# Altium schematic sheet uC.SchDoc: Microcontroller
size A3; Author: Valentin Py; DrawnBy: Valentin Py; Engineer: Valentin Py; Address1: valentin.py@gmail.com; SheetNumber: 4; SheetTotal: 5; PageSetup: Record=PageOptions|CenterHorizontal=True|CenterVertical=True|PrintScale=0.24|XCorrection=1.00|YCorrection=1.00|PrintKind=0|BorderSize=5000000|LeftOffset=0|BottomOffset=0|Orientation=2|PaperLength=1000|PaperWidth=1000|Scale=100|PaperSource=7|PrintQuality=-4|MediaType=1|DitherType=10|PaperKind=A4|PrintScaleMode=1
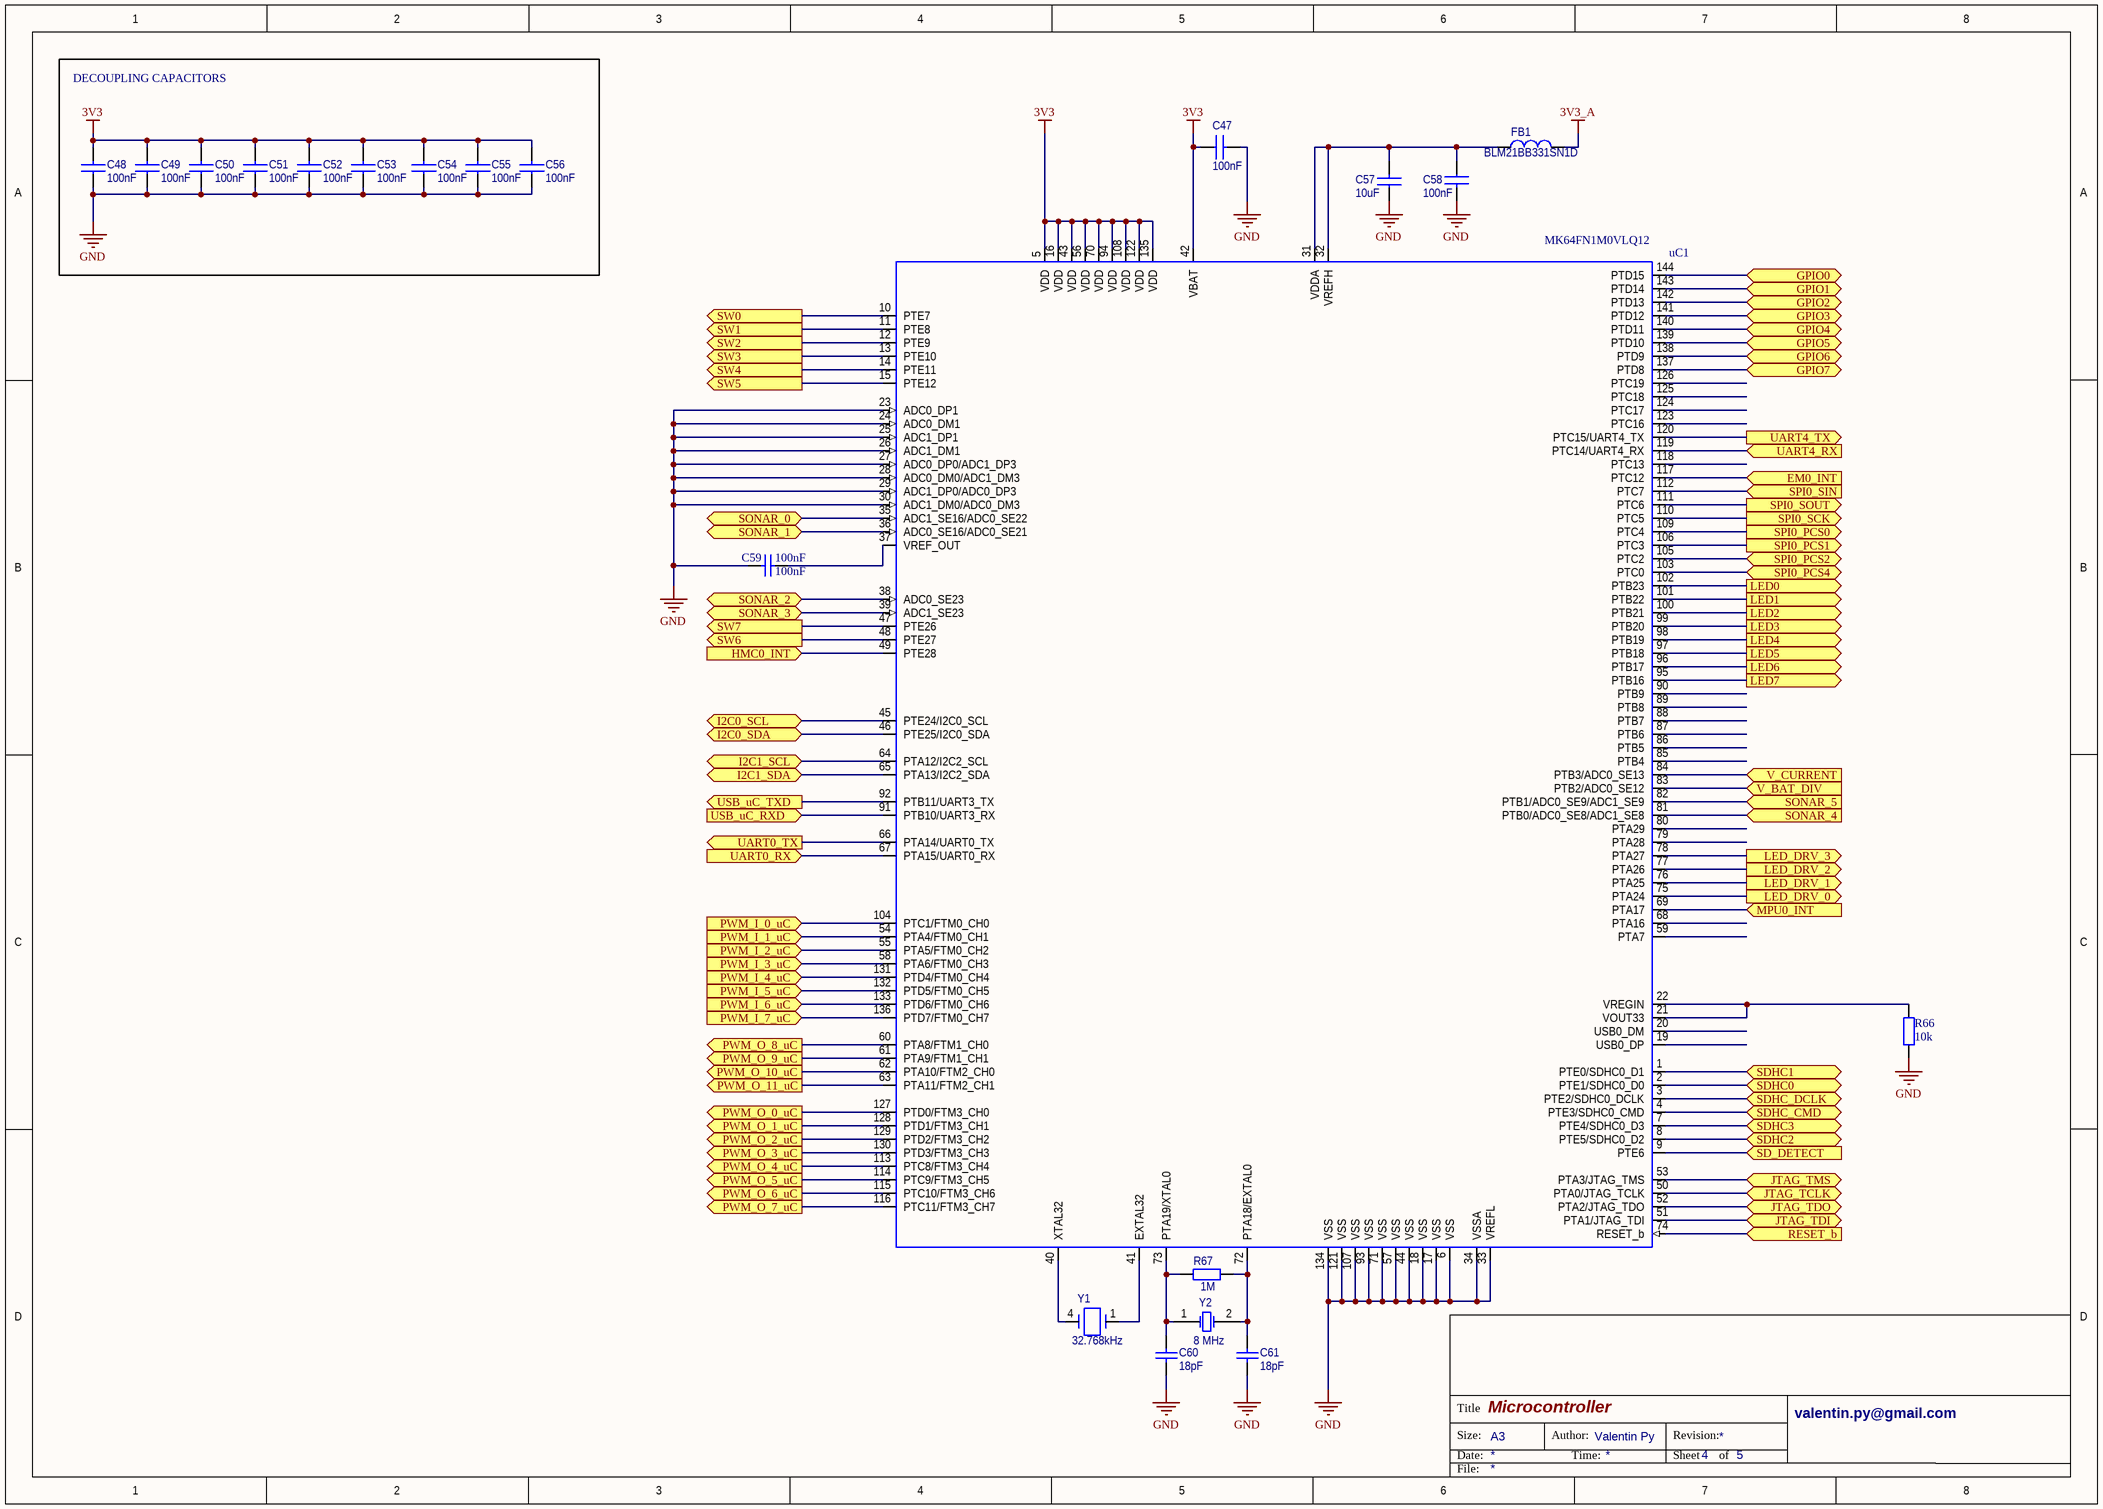
[diagram p0: uC.SchDoc]

## Parts
C47  100nF  [080503]
C48  100nF  [080503]
C49  100nF  [080503]
C50  100nF  [080503]
C51  100nF  [080503]
C52  100nF  [080503]
C53  100nF  [080503]
C54  100nF  [080503]
C55  100nF  [080503]
C56  100nF  [080503]
C57  10uF  [080503]
C58  100nF  [080503]
C59  100nF  [080503]
C60  18pF  [060301]
C61  18pF  [060301]
FB1  BLM21BB331SN1D  [080501]
R66  10k  [060301]
R67  1M  [060301]
uC1  MK64FN1M0VLQ12  [LQFP 144]
Y1  value 32.768kHz  [XT-5]  (hidden comment: CRYSTAL 32.768k)
Y2  value 8 MHz  [XT8_2-SMD]  (hidden comment: ABM3-8.000MHZ-D2Y-T)

## Blocks framed on the sheet
DECOUPLING CAPACITORS: C48-C56

## Ports
EM0_INT (in), GPIO0 (bidir), GPIO1 (bidir), GPIO2 (bidir), GPIO3 (bidir), GPIO4 (bidir), GPIO5 (bidir), GPIO6 (bidir), GPIO7 (bidir), HMC0_INT (in), I2C0_SCL (bidir), I2C0_SDA (bidir), I2C1_SCL (bidir), I2C1_SDA, JTAG_TCLK, JTAG_TDI, JTAG_TDO, JTAG_TMS, LED0 (out), LED1 (out), LED2 (out), LED3 (out), LED4 (out), LED5 (out), LED6 (out), LED7 (out), LED_DRV_0 (out), LED_DRV_1 (out), LED_DRV_2 (out), LED_DRV_3 (out), MPU0_INT (in), PWM_I_0_uC (in), PWM_I_1_uC (in), PWM_I_2_uC (in), PWM_I_3_uC (in), PWM_I_4_uC (in), PWM_I_5_uC (in), PWM_I_6_uC (in), PWM_I_7_uC (in), PWM_O_0_uC (out), PWM_O_1_uC (out), PWM_O_2_uC (out), PWM_O_3_uC (out), PWM_O_4_uC (out), PWM_O_5_uC (out), PWM_O_6_uC (out), PWM_O_7_uC (out), PWM_O_8_uC (out), PWM_O_9_uC (out), PWM_O_10_uC (out), PWM_O_11_uC (out), RESET_b (in), SD_DETECT (in), SDHC0, SDHC1, SDHC2, SDHC3, SDHC_CMD, SDHC_DCLK, SONAR_0, SONAR_1, SONAR_2, SONAR_3, SONAR_4 (in), SONAR_5 (in), SPI0_PCS0 (out), SPI0_PCS1 (out), SPI0_PCS2, SPI0_PCS4, SPI0_SCK (out), SPI0_SIN (in), SPI0_SOUT (out), SW0 (out), SW1 (out), SW2 (out), SW3 (out), SW4 (out), SW5 (out), SW6 (out), SW7 (out), UART0_RX (in), UART0_TX (out), UART4_RX (in), UART4_TX (out), USB_uC_RXD (in), USB_uC_TXD (out), V_BAT_DIV (in), V_CURRENT (in)

## Nets
3V3: C47.1 C48.2 C49.2 C50.2 C51.2 C52.2 C53.2 C54.2 C55.2 C56.2 uC1.5(VDD) uC1.16(VDD) uC1.42(VBAT) uC1.43(VDD) uC1.56(VDD) uC1.70(VDD) uC1.94(VDD) uC1.108(VDD) uC1.122(VDD) uC1.135(VDD)
3V3_A: FB1.2
GND: C47.2 C48.1 C49.1 C50.1 C51.1 C52.1 C53.1 C54.1 C55.1 C56.1 C57.1 C58.2 C59.2 C60.1 C61.1 R66.1 uC1.6(VSS) uC1.17(VSS) uC1.18(VSS) uC1.23(ADC0_DP1) uC1.24(ADC0_DM1) uC1.25(ADC1_DP1) uC1.26(ADC1_DM1) uC1.27(ADC0_DP0/ADC1_DP3) uC1.28(ADC0_DM0/ADC1_DM3) uC1.29(ADC1_DP0/ADC0_DP3) uC1.30(ADC1_DM0/ADC0_DM3) uC1.33(VREFL) uC1.34(VSSA) uC1.44(VSS) uC1.57(VSS) uC1.71(VSS) uC1.93(VSS) uC1.107(VSS) uC1.121(VSS) uC1.134(VSS)
EM0_INT: uC1.117(PTC12) ; port EM0_INT
GPIO0: uC1.144(PTD15) ; port GPIO0
GPIO1: uC1.143(PTD14) ; port GPIO1
GPIO2: uC1.142(PTD13) ; port GPIO2
GPIO3: uC1.141(PTD12) ; port GPIO3
GPIO4: uC1.140(PTD11) ; port GPIO4
GPIO5: uC1.139(PTD10) ; port GPIO5
GPIO6: uC1.138(PTD9) ; port GPIO6
GPIO7: uC1.137(PTD8) ; port GPIO7
HMC0_INT: uC1.49(PTE28) ; port HMC0_INT
I2C0_SCL: uC1.45(PTE24/I2C0_SCL) ; port I2C0_SCL
I2C0_SDA: uC1.46(PTE25/I2C0_SDA) ; port I2C0_SDA
I2C1_SCL: uC1.64(PTA12/I2C2_SCL) ; port I2C1_SCL
I2C1_SDA: uC1.65(PTA13/I2C2_SDA) ; port I2C1_SDA
JTAG_TCLK: uC1.50(PTA0/JTAG_TCLK) ; port JTAG_TCLK
JTAG_TDI: uC1.51(PTA1/JTAG_TDI) ; port JTAG_TDI
JTAG_TDO: uC1.52(PTA2/JTAG_TDO) ; port JTAG_TDO
JTAG_TMS: uC1.53(PTA3/JTAG_TMS) ; port JTAG_TMS
LED0: uC1.102(PTB23) ; port LED0
LED1: uC1.101(PTB22) ; port LED1
LED2: uC1.100(PTB21) ; port LED2
LED3: uC1.99(PTB20) ; port LED3
LED4: uC1.98(PTB19) ; port LED4
LED5: uC1.97(PTB18) ; port LED5
LED6: uC1.96(PTB17) ; port LED6
LED7: uC1.95(PTB16) ; port LED7
LED_DRV_0: uC1.75(PTA24) ; port LED_DRV_0
LED_DRV_1: uC1.76(PTA25) ; port LED_DRV_1
LED_DRV_2: uC1.77(PTA26) ; port LED_DRV_2
LED_DRV_3: uC1.78(PTA27) ; port LED_DRV_3
MPU0_INT: uC1.69(PTA17) ; port MPU0_INT
PWM_I_0_uC: uC1.104(PTC1/FTM0_CH0) ; port PWM_I_0_uC
PWM_I_1_uC: uC1.54(PTA4/FTM0_CH1) ; port PWM_I_1_uC
PWM_I_2_uC: uC1.55(PTA5/FTM0_CH2) ; port PWM_I_2_uC
PWM_I_3_uC: uC1.58(PTA6/FTM0_CH3) ; port PWM_I_3_uC
PWM_I_4_uC: uC1.131(PTD4/FTM0_CH4) ; port PWM_I_4_uC
PWM_I_5_uC: uC1.132(PTD5/FTM0_CH5) ; port PWM_I_5_uC
PWM_I_6_uC: uC1.133(PTD6/FTM0_CH6) ; port PWM_I_6_uC
PWM_I_7_uC: uC1.136(PTD7/FTM0_CH7) ; port PWM_I_7_uC
PWM_O_0_uC: uC1.127(PTD0/FTM3_CH0) ; port PWM_O_0_uC
PWM_O_1_uC: uC1.128(PTD1/FTM3_CH1) ; port PWM_O_1_uC
PWM_O_2_uC: uC1.129(PTD2/FTM3_CH2) ; port PWM_O_2_uC
PWM_O_3_uC: uC1.130(PTD3/FTM3_CH3) ; port PWM_O_3_uC
PWM_O_4_uC: uC1.113(PTC8/FTM3_CH4) ; port PWM_O_4_uC
PWM_O_5_uC: uC1.114(PTC9/FTM3_CH5) ; port PWM_O_5_uC
PWM_O_6_uC: uC1.115(PTC10/FTM3_CH6) ; port PWM_O_6_uC
PWM_O_7_uC: uC1.116(PTC11/FTM3_CH7) ; port PWM_O_7_uC
PWM_O_8_uC: uC1.60(PTA8/FTM1_CH0) ; port PWM_O_8_uC
PWM_O_9_uC: uC1.61(PTA9/FTM1_CH1) ; port PWM_O_9_uC
PWM_O_10_uC: uC1.62(PTA10/FTM2_CH0) ; port PWM_O_10_uC
PWM_O_11_uC: uC1.63(PTA11/FTM2_CH1) ; port PWM_O_11_uC
RESET_b: uC1.74(RESET_b) ; port RESET_b
SD_DETECT: uC1.9(PTE6) ; port SD_DETECT
SDHC0: uC1.2(PTE1/SDHC0_D0) ; port SDHC0
SDHC1: uC1.1(PTE0/SDHC0_D1) ; port SDHC1
SDHC2: uC1.8(PTE5/SDHC0_D2) ; port SDHC2
SDHC3: uC1.7(PTE4/SDHC0_D3) ; port SDHC3
SDHC_CMD: uC1.4(PTE3/SDHC0_CMD) ; port SDHC_CMD
SDHC_DCLK: uC1.3(PTE2/SDHC0_DCLK) ; port SDHC_DCLK
SONAR_0: uC1.35(ADC1_SE16/ADC0_SE22) ; port SONAR_0
SONAR_1: uC1.36(ADC0_SE16/ADC0_SE21) ; port SONAR_1
SONAR_2: uC1.38(ADC0_SE23) ; port SONAR_2
SONAR_3: uC1.39(ADC1_SE23) ; port SONAR_3
SONAR_4: uC1.81(PTB0/ADC0_SE8/ADC1_SE8) ; port SONAR_4
SONAR_5: uC1.82(PTB1/ADC0_SE9/ADC1_SE9) ; port SONAR_5
SPI0_PCS0: uC1.109(PTC4) ; port SPI0_PCS0
SPI0_PCS1: uC1.106(PTC3) ; port SPI0_PCS1
SPI0_PCS2: uC1.105(PTC2) ; port SPI0_PCS2
SPI0_PCS4: uC1.103(PTC0) ; port SPI0_PCS4
SPI0_SCK: uC1.110(PTC5) ; port SPI0_SCK
SPI0_SIN: uC1.112(PTC7) ; port SPI0_SIN
SPI0_SOUT: uC1.111(PTC6) ; port SPI0_SOUT
SW0: uC1.10(PTE7) ; port SW0
SW1: uC1.11(PTE8) ; port SW1
SW2: uC1.12(PTE9) ; port SW2
SW3: uC1.13(PTE10) ; port SW3
SW4: uC1.14(PTE11) ; port SW4
SW5: uC1.15(PTE12) ; port SW5
SW6: uC1.48(PTE27) ; port SW6
SW7: uC1.47(PTE26) ; port SW7
UART0_RX: uC1.67(PTA15/UART0_RX) ; port UART0_RX
UART0_TX: uC1.66(PTA14/UART0_TX) ; port UART0_TX
UART4_RX: uC1.119(PTC14/UART4_RX) ; port UART4_RX
UART4_TX: uC1.120(PTC15/UART4_TX) ; port UART4_TX
USB_uC_RXD: uC1.91(PTB10/UART3_RX) ; port USB_uC_RXD
USB_uC_TXD: uC1.92(PTB11/UART3_TX) ; port USB_uC_TXD
V_BAT_DIV: uC1.83(PTB2/ADC0_SE12) ; port V_BAT_DIV
V_CURRENT: uC1.84(PTB3/ADC0_SE13) ; port V_CURRENT
NetC57_2: C57.2 C58.1 FB1.1 uC1.31(VDDA) uC1.32(VREFH)
NetC59_1: C59.1 uC1.37(VREF_OUT)
NetC60_2: C60.2 R67.1 uC1.73(PTA19/XTAL0) Y2.1(OSC1)
NetC61_2: C61.2 R67.2 uC1.72(PTA18/EXTAL0) Y2.2(OSC2)
NetR66_2: R66.2 uC1.21(VOUT33) uC1.22(VREGIN)
NetuC1_40: uC1.40(XTAL32) Y1.4
NetuC1_41: uC1.41(EXTAL32) Y1.1

Not connected (* = marked no-connect by the designer): uC1 19(USB0_DP) 20(USB0_DM) 59(PTA7) 68(PTA16) 79(PTA28) 80(PTA29) 85(PTB4) 86(PTB5) 87(PTB6) 88(PTB7) 89(PTB8) 90(PTB9) 118(PTC13) 123(PTC16) 124(PTC17) 125(PTC18) 126(PTC19)

## Notes on the sheet
- Title
- Size:
- Date:
- A3
- Author:
- Time:
- Revision:
- Sheet
- of
- File:

## Library data of the parts
C47-C56 C58 = CAPA: CAP CER 0.1UF 25V 10% X7R 0805; Value: 100nF; Supplier 1: Digi-Key; Supplier Part Number 1: 1276-1099-1-ND
C57 = CAPA: CAP CER 10UF 16V 20% X6S 0805; Value: 10uF; Supplier 1: Digi-Key; Supplier Part Number 1: 445-7612-1-ND
C59 = CAP: CAP CER 0.1UF 25V 10% X7R 0805; Value: 100nF; Supplier 1: Digi-Key; Supplier Part Number 1: 1276-1099-1-ND
C60 C61 = Cap Semi: CAP CER 18PF 50V 5% NP0 0603; Value: 18pF; Supplier 1: Digi-Key; Supplier Part Number 1: 399-1052-6-ND
FB1 = Ferrite Bead: EMI Filter Beads, Chips & Arrays 0805 330 OHM; Value: 300R@100MHz; Supplier 1: Mouser; Supplier Part Number 1: 81-BLM21BB331SN1D
R66 = RES: RES 10K 0805; Value: 10k; Supplier 1: Digi-Key; Supplier Part Number 1: RHM10.0KCFCT-ND
R67 = RES: RES 1M 0603; Value: 1M; Supplier 1: Digi-Key; Supplier Part Number 1: 311-1.00MHRCT-ND
Y1 = Crystal_32: CRYSTAL 32.768 KHZ 12.5PF SMD; Supplier 1: Digi-Key; Supplier Part Number 1: XC1912CT-ND
Y2 = XTAL: CRYSTAL 8MHZ 18PF SMD; Supplier 1: Digi-Key; Supplier Part Number 1: 535-10630-6-ND
uC1 = MK64FN1M0VLQ12: Supplier 1: Digi-Key; Supplier Part Number 1: MK64FN1M0VLQ12-ND